# Altium project HAB-Main-Flight-Computer-Card-Template.PrjPcb (part 2 of 4)

## Sheet NetworkSwitch.SchDoc
size A2; Organization: Altium Limited; Address1: L3, 12a Rodborough Rd; Address2: Frenchs Forest; Address3: NSW; Address4: Australia 2086
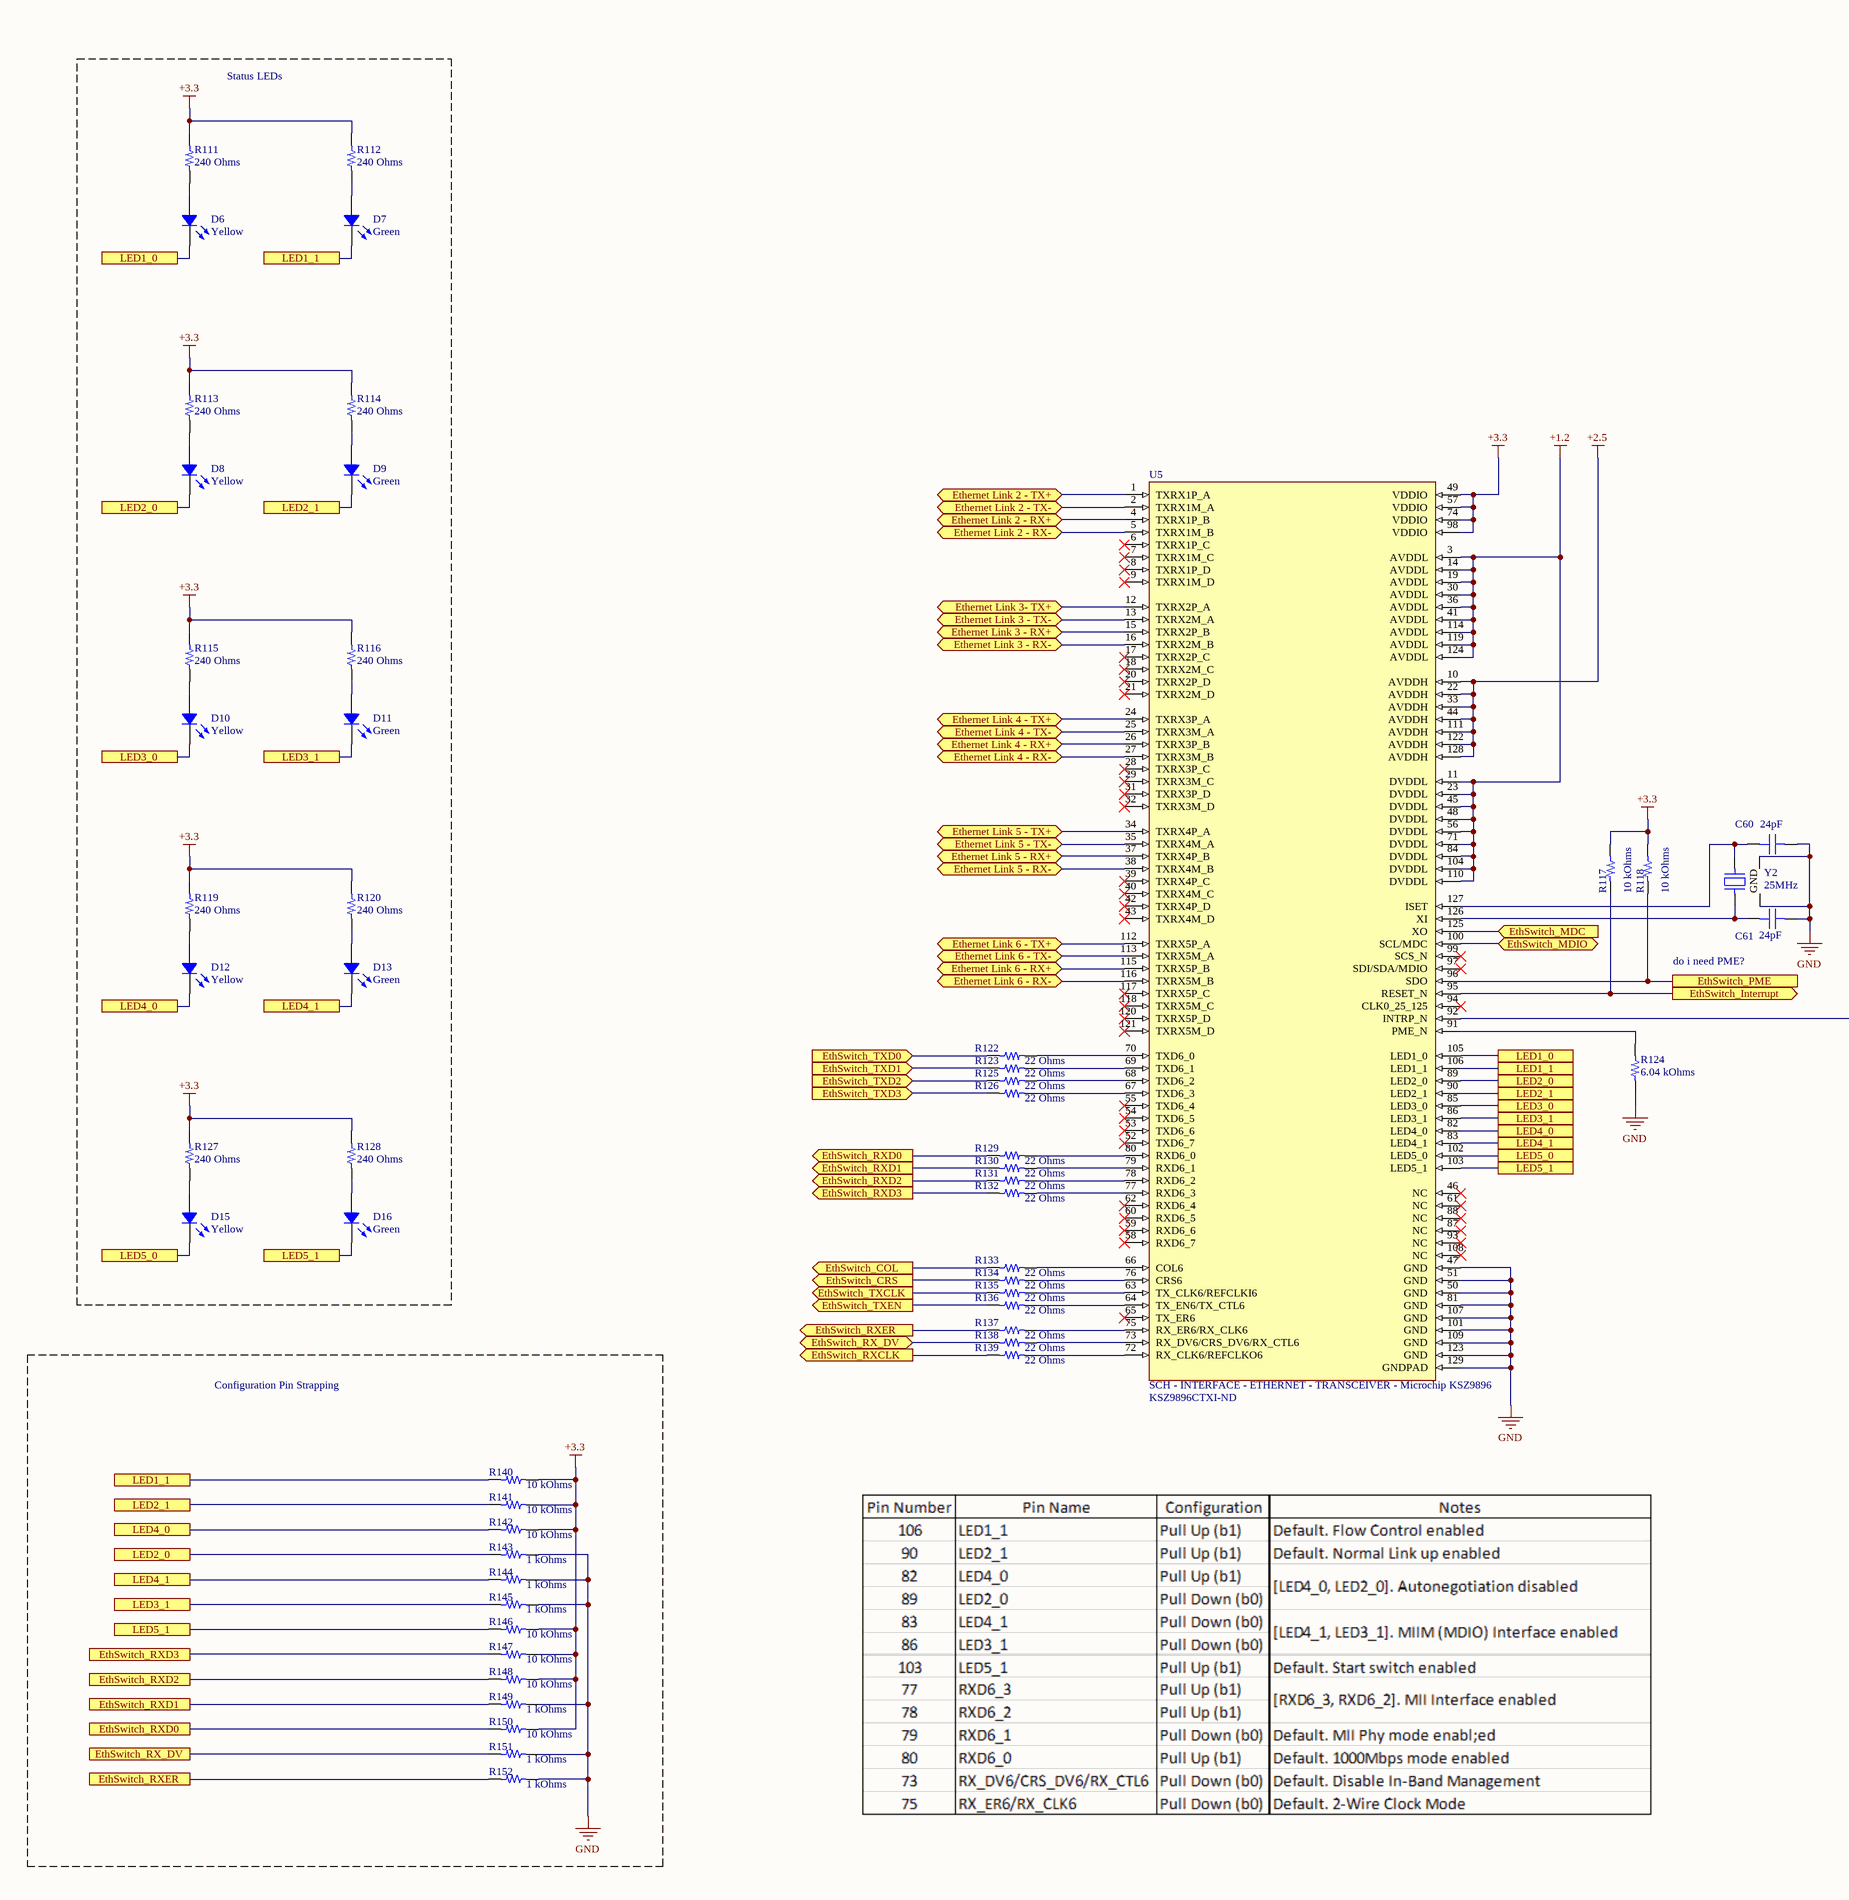
[diagram p2: NetworkSwitch.SchDoc, left]
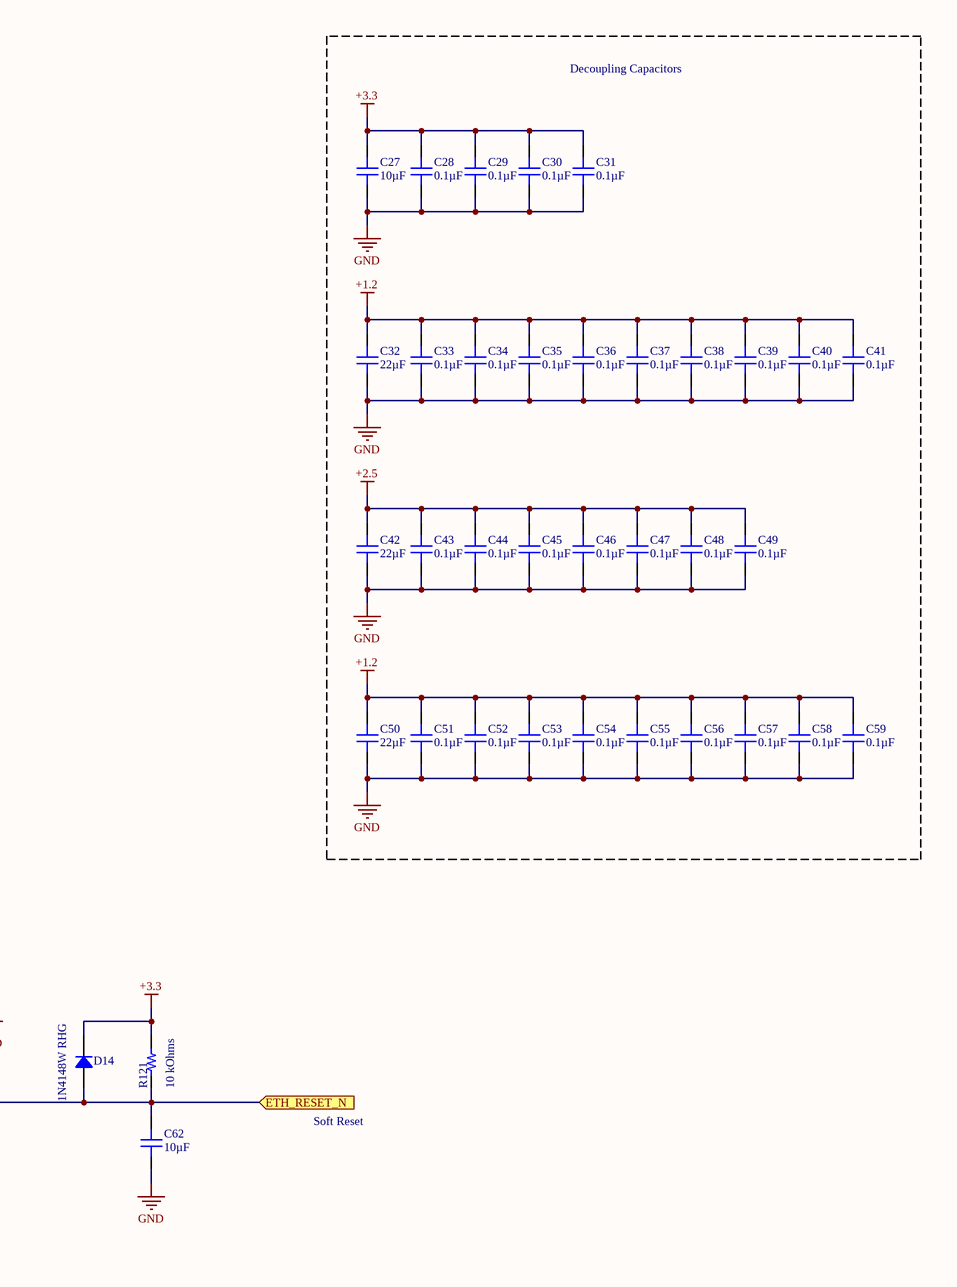
[diagram p3: NetworkSwitch.SchDoc, right]

### Parts
(Parts that share a designator on the sheet are numbered #1, #2 ... from top to bottom, then left to right.)
C27  10µF  [CAP 0805_2012]
C28  0.1µF  [CAP 0603_1608]
C29  0.1µF  [CAP 0603_1608]
C30  0.1µF  [CAP 0603_1608]
C31  0.1µF  [CAP 0603_1608]
C32  22µF  [CAP 0805_2012]
C33  0.1µF  [CAP 0603_1608]
C34  0.1µF  [CAP 0603_1608]
C35  0.1µF  [CAP 0603_1608]
C36  0.1µF  [CAP 0603_1608]
C37  0.1µF  [CAP 0603_1608]
C38  0.1µF  [CAP 0603_1608]
C39  0.1µF  [CAP 0603_1608]
C40  0.1µF  [CAP 0603_1608]
C41  0.1µF  [CAP 0603_1608]
C42  22µF  [CAP 0805_2012]
C43  0.1µF  [CAP 0603_1608]
C44  0.1µF  [CAP 0603_1608]
C45  0.1µF  [CAP 0603_1608]
C46  0.1µF  [CAP 0603_1608]
C47  0.1µF  [CAP 0603_1608]
C48  0.1µF  [CAP 0603_1608]
C49  0.1µF  [CAP 0603_1608]
C50  22µF  [CAP 0805_2012]
C51  0.1µF  [CAP 0603_1608]
C52  0.1µF  [CAP 0603_1608]
C53  0.1µF  [CAP 0603_1608]
C54  0.1µF  [CAP 0603_1608]
C55  0.1µF  [CAP 0603_1608]
C56  0.1µF  [CAP 0603_1608]
C57  0.1µF  [CAP 0603_1608]
C58  0.1µF  [CAP 0603_1608]
C59  0.1µF  [CAP 0603_1608]
C60  24pF  [CAP 0603_1608]
C61  24pF  [CAP 0603_1608]
C62  10µF  [CAP 0805_2012]
D6  Yellow  [LED 0603_1608 YELLOW]
D7  Green  [LED 0603_1608 GREEN]
D8  Yellow  [LED 0603_1608 YELLOW]
D9  Green  [LED 0603_1608 GREEN]
D10  Yellow  [LED 0603_1608 YELLOW]
D11  Green  [LED 0603_1608 GREEN]
D12  Yellow  [LED 0603_1608 YELLOW]
D13  Green  [LED 0603_1608 GREEN]
D14#1  1N4148W RHG  [SOD123F]
D15#1  Yellow  [LED 0603_1608 YELLOW]
D16#1  Green  [LED 0603_1608 GREEN]
R111  240 Ohms  [RES 0603_1608]
R112  240 Ohms  [RES 0603_1608]
R113  240 Ohms  [RES 0603_1608]
R114  240 Ohms  [RES 0603_1608]
R115  240 Ohms  [RES 0603_1608]
R116  240 Ohms  [RES 0603_1608]
R117  10 kOhms  [RES 0603_1608]
R118  10 kOhms  [RES 0603_1608]
R119  240 Ohms  [RES 0603_1608]
R120  240 Ohms  [RES 0603_1608]
R121#1  10 kOhms  [RES 0603_1608]
R122#1  22 Ohms  [RES 0603_1608]
R123#1  22 Ohms  [RES 0603_1608]
R124#1  6.04 kOhms  [RES 0603_1608]
R125#1  22 Ohms  [RES 0603_1608]
R126#1  22 Ohms  [RES 0603_1608]
R127#1  240 Ohms  [RES 0603_1608]
R128#1  240 Ohms  [RES 0603_1608]
R129#1  22 Ohms  [RES 0603_1608]
R130#1  22 Ohms  [RES 0603_1608]
R131#1  22 Ohms  [RES 0603_1608]
R132#1  22 Ohms  [RES 0603_1608]
R133#1  22 Ohms  [RES 0603_1608]
R134#1  22 Ohms  [RES 0603_1608]
R135#1  22 Ohms  [RES 0603_1608]
R136  22 Ohms  [RES 0603_1608]
R137  22 Ohms  [RES 0603_1608]
R138  22 Ohms  [RES 0603_1608]
R139  22 Ohms  [RES 0603_1608]
R140  10 kOhms  [RES 0603_1608]
R141  10 kOhms  [RES 0603_1608]
R142  10 kOhms  [RES 0603_1608]
R143  1 kOhms  [RES 0603_1608]
R144  1 kOhms  [RES 0603_1608]
R145  1 kOhms  [RES 0603_1608]
R146  10 kOhms  [RES 0603_1608]
R147#1  10 kOhms  [RES 0603_1608]
R148  10 kOhms  [RES 0603_1608]
R149  1 kOhms  [RES 0603_1608]
R150  10 kOhms  [RES 0603_1608]
R151  1 kOhms  [RES 0603_1608]
R152  1 kOhms  [RES 0603_1608]
U5#2  SCH - INTERFACE - ETHERNET - TRANSCEIVER - Microchip KSZ9896  Supplier Part Number 1: KSZ9896CTXI-ND  [PCB - LEADS - QFP - Microchip 128-TQFP]
Y2#1  25MHz  [EPSON TSX-3225]

### Blocks framed on the sheet
Status LEDs: D6-D13 D15#1 D16#1 R111-R116 R119 R120 R127#1 R128#1
Decoupling Capacitors: C27-C59
Configuration Pin Strapping: R140-R146 R147#1 R148-R152

### Ports
ETH_RESET_N (in), Ethernet Link 2 - RX+ (bidir), Ethernet Link 2 - RX- (bidir), Ethernet Link 2 - TX+ (bidir), Ethernet Link 2 - TX- (bidir), Ethernet Link 3 - RX+ (bidir), Ethernet Link 3 - RX- (bidir), Ethernet Link 3 - TX- (bidir), Ethernet Link 3- TX+ (bidir), Ethernet Link 4 - RX+ (bidir), Ethernet Link 4 - RX- (bidir), Ethernet Link 4 - TX+ (bidir), Ethernet Link 4 - TX- (bidir), Ethernet Link 5 - RX+ (bidir), Ethernet Link 5 - RX- (bidir), Ethernet Link 5 - TX+ (bidir), Ethernet Link 5 - TX- (bidir), Ethernet Link 6 - RX+ (bidir), Ethernet Link 6 - RX- (bidir), Ethernet Link 6 - TX+ (bidir), Ethernet Link 6 - TX- (bidir), EthSwitch_COL (out), EthSwitch_CRS (out), EthSwitch_Interrupt (out), EthSwitch_MDC (in), EthSwitch_MDIO (bidir), EthSwitch_PME, EthSwitch_RX_DV, EthSwitch_RX_DV (bidir), EthSwitch_RXCLK (out), EthSwitch_RXD0, EthSwitch_RXD0 (out), EthSwitch_RXD1, EthSwitch_RXD1 (out), EthSwitch_RXD2, EthSwitch_RXD2 (out), EthSwitch_RXD3, EthSwitch_RXD3 (out), EthSwitch_RXER, EthSwitch_RXER (out), EthSwitch_TXCLK (out), EthSwitch_TXD0 (in), EthSwitch_TXD1 (in), EthSwitch_TXD2 (in), EthSwitch_TXD3 (in), EthSwitch_TXEN (out), LED1_0, LED1_1, LED2_0, LED2_1, LED3_0, LED3_1, LED4_0, LED4_1, LED5_0, LED5_1

### Nets
+1.2: C32.2 C33.2 C34.2 C35.2 C36.2 C37.2 C38.2 C39.2 C40.2 C41.2 C50.2 C51.2 C52.2 C53.2 C54.2 C55.2 C56.2 C57.2 C58.2 C59.2 U5#2.3(AVDDL) U5#2.11(DVDDL) U5#2.14(AVDDL) U5#2.19(AVDDL) U5#2.23(DVDDL) U5#2.30(AVDDL) U5#2.36(AVDDL) U5#2.41(AVDDL) U5#2.45(DVDDL) U5#2.48(DVDDL) U5#2.56(DVDDL) U5#2.71(DVDDL) U5#2.84(DVDDL) U5#2.104(DVDDL) U5#2.110(DVDDL) U5#2.114(AVDDL) U5#2.119(AVDDL) U5#2.124(AVDDL)
+2.5: C42.2 C43.2 C44.2 C45.2 C46.2 C47.2 C48.2 C49.2 U5#2.10(AVDDH) U5#2.22(AVDDH) U5#2.33(AVDDH) U5#2.44(AVDDH) U5#2.111(AVDDH) U5#2.122(AVDDH) U5#2.128(AVDDH)
+3.3: C27.2 C28.2 C29.2 C30.2 C31.2 D14#1.2 R111.2 R112.2 R113.2 R114.2 R115.2 R116.2 R117.2 R118.2 R119.2 R120.2 R121#1.2 R127#1.2 R128#1.2 R140.1 R141.1 R142.1 R146.1 R147#1.1 R148.1 R150.1 U5#2.49(VDDIO) U5#2.57(VDDIO) U5#2.74(VDDIO) U5#2.98(VDDIO)
GND: C27.1 C28.1 C29.1 C30.1 C31.1 C32.1 C33.1 C34.1 C35.1 C36.1 C37.1 C38.1 C39.1 C40.1 C41.1 C42.1 C43.1 C44.1 C45.1 C46.1 C47.1 C48.1 C49.1 C50.1 C51.1 C52.1 C53.1 C54.1 C55.1 C56.1 C57.1 C58.1 C59.1 C60.2 C61.2 C62.1 R124#1.1 R143.1 R144.1 R145.1 R149.1 R151.1 R152.1 U5#2.47(GND) U5#2.50(GND) U5#2.51(GND) U5#2.81(GND) U5#2.101(GND) U5#2.107(GND) U5#2.109(GND) U5#2.123(GND) U5#2.129(GNDPAD) Y2#1.2(GND) Y2#1.4(GND)
ETH2_RX_N: U5#2.5(TXRX1M_B) ; port Ethernet Link 2 - RX-
ETH2_RX_P: U5#2.4(TXRX1P_B) ; port Ethernet Link 2 - RX+
ETH2_TX_N: U5#2.2(TXRX1M_A) ; port Ethernet Link 2 - TX-
ETH2_TX_P: U5#2.1(TXRX1P_A) ; port Ethernet Link 2 - TX+
ETH3_RX_N: U5#2.16(TXRX2M_B) ; port Ethernet Link 3 - RX-
ETH3_RX_P: U5#2.15(TXRX2P_B) ; port Ethernet Link 3 - RX+
ETH3_TX_N: U5#2.13(TXRX2M_A) ; port Ethernet Link 3 - TX-
ETH3_TX_P: U5#2.12(TXRX2P_A) ; port Ethernet Link 3- TX+
ETH4_RX_N: U5#2.27(TXRX3M_B) ; port Ethernet Link 4 - RX-
ETH4_RX_P: U5#2.26(TXRX3P_B) ; port Ethernet Link 4 - RX+
ETH4_TX_N: U5#2.25(TXRX3M_A) ; port Ethernet Link 4 - TX-
ETH4_TX_P: U5#2.24(TXRX3P_A) ; port Ethernet Link 4 - TX+
ETH5_RX_N: U5#2.38(TXRX4M_B) ; port Ethernet Link 5 - RX-
ETH5_RX_P: U5#2.37(TXRX4P_B) ; port Ethernet Link 5 - RX+
ETH5_TX_N: U5#2.35(TXRX4M_A) ; port Ethernet Link 5 - TX-
ETH5_TX_P: U5#2.34(TXRX4P_A) ; port Ethernet Link 5 - TX+
ETH6_RX_N: U5#2.116(TXRX5M_B) ; port Ethernet Link 6 - RX-
ETH6_RX_P: U5#2.115(TXRX5P_B) ; port Ethernet Link 6 - RX+
ETH6_TX_N: U5#2.113(TXRX5M_A) ; port Ethernet Link 6 - TX-
ETH6_TX_P: U5#2.112(TXRX5P_A) ; port Ethernet Link 6 - TX+
NetC60_1: C60.1 U5#2.127(ISET) Y2#1.3
NetC61_1: C61.1 U5#2.126(XI) Y2#1.1
NetC62_2: C62.2 D14#1.1 R121#1.1 U5#2.92(INTRP_N) ; port ETH_RESET_N
NetD6_1: D6.1 R111.1
NetD6_2: D6.2 U5#2.105(LED1_0) ; port LED1_0
NetD7_1: D7.1 R112.1
NetD7_2: D7.2 R140.2 U5#2.106(LED1_1) ; port LED1_1
NetD8_1: D8.1 R113.1
NetD8_2: D8.2 R143.2 U5#2.89(LED2_0) ; port LED2_0
NetD9_1: D9.1 R114.1
NetD9_2: D9.2 R141.2 U5#2.90(LED2_1) ; port LED2_1
NetD10_1: D10.1 R115.1
NetD10_2: D10.2 U5#2.85(LED3_0) ; port LED3_0
NetD11_1: D11.1 R116.1
NetD11_2: D11.2 R145.2 U5#2.86(LED3_1) ; port LED3_1
NetD12_1: D12.1 R119.1
NetD12_2: D12.2 R142.2 U5#2.82(LED4_0) ; port LED4_0
NetD13_1: D13.1 R120.1
NetD13_2: D13.2 R144.2 U5#2.83(LED4_1) ; port LED4_1
NetD15#1_1: D15#1.1 R127#1.1
NetD15#1_2: D15#1.2 U5#2.102(LED5_0) ; port LED5_0
NetD16#1_1: D16#1.1 R128#1.1
NetD16#1_2: D16#1.2 R146.2 U5#2.103(LED5_1) ; port LED5_1
NetR62_2: R122#1.1 ; port EthSwitch_TXD0
NetR63_2: R123#1.1 ; port EthSwitch_TXD1
NetR64_2: R125#1.1 ; port EthSwitch_TXD2
NetR65_2: R126#1.1 ; port EthSwitch_TXD3
NetR117_1: R117.1 U5#2.95(RESET_N) ; port EthSwitch_Interrupt
NetR118_1: R118.1 U5#2.96(SDO) ; port EthSwitch_PME
NetR122#1_2: R122#1.2 U5#2.70(TXD6_0)
NetR123#1_2: R123#1.2 U5#2.69(TXD6_1)
NetR124#1_2: R124#1.2 U5#2.91(PME_N)
NetR125#1_2: R125#1.2 U5#2.68(TXD6_2)
NetR126#1_2: R126#1.2 U5#2.67(TXD6_3)
NetR129#1_1: R129#1.1 R150.2 ; port EthSwitch_RXD0
NetR129#1_2: R129#1.2 U5#2.80(RXD6_0)
NetR130#1_1: R130#1.1 R149.2 ; port EthSwitch_RXD1
NetR130#1_2: R130#1.2 U5#2.79(RXD6_1)
NetR131#1_1: R131#1.1 R148.2 ; port EthSwitch_RXD2
NetR131#1_2: R131#1.2 U5#2.78(RXD6_2)
NetR131#2_1: U5#2.100(SCL/MDC) ; port EthSwitch_MDIO
NetR132#1_1: R132#1.1 R147#1.2 ; port EthSwitch_RXD3
NetR132#1_2: R132#1.2 U5#2.77(RXD6_3)
NetR133#1_1: R133#1.1 ; port EthSwitch_COL
NetR133#1_2: R133#1.2 U5#2.66(COL6)
NetR134#1_1: R134#1.1 ; port EthSwitch_CRS
NetR134#1_2: R134#1.2 U5#2.76(CRS6)
NetR135#1_1: R135#1.1 ; port EthSwitch_TXCLK
NetR135#1_2: R135#1.2 U5#2.63(TX_CLK6/REFCLKI6)
NetR136_1: R136.1 ; port EthSwitch_TXEN
NetR136_2: R136.2 U5#2.64(TX_EN6/TX_CTL6)
NetR137_1: R137.1 R152.2 ; port EthSwitch_RXER
NetR137_2: R137.2 U5#2.75(RX_ER6/RX_CLK6)
NetR138_1: R138.1 R151.2 ; port EthSwitch_RX_DV
NetR138_2: R138.2 U5#2.73(RX_DV6/CRS_DV6/RX_CTL6)
NetR139_1: R139.1 ; port EthSwitch_RXCLK
NetR139_2: R139.2 U5#2.72(RX_CLK6/REFCLKO6)
NetU5#2_125: U5#2.125(XO) ; port EthSwitch_MDC

Not connected (* = marked no-connect by the designer): U5#2 6(TXRX1P_C)* 7(TXRX1M_C)* 8(TXRX1P_D)* 9(TXRX1M_D)* 17(TXRX2P_C)* 18(TXRX2M_C)* 20(TXRX2P_D)* 21(TXRX2M_D)* 28(TXRX3P_C)* 29(TXRX3M_C)* 31(TXRX3P_D)* 32(TXRX3M_D)* 39(TXRX4P_C)* 40(TXRX4M_C)* 42(TXRX4P_D)* 43(TXRX4M_D)* 46(NC)* 52(TXD6_7)* 53(TXD6_6)* 54(TXD6_5)* 55(TXD6_4)* 58(RXD6_7)* 59(RXD6_6)* 60(RXD6_5)* 61(NC)* 62(RXD6_4)* 65(TX_ER6)* 87(NC)* 88(NC)* 93(NC)* 94(CLK0_25_125)* 97(SDI/SDA/MDIO)* 99(SCS_N)* 108(NC)* 117(TXRX5P_C)* 118(TXRX5M_C)* 120(TXRX5P_D)* 121(TXRX5M_D)*

### Notes on the sheet
- (near C61) do i need PME?
- Soft Reset
- Title
- Size:
- Date:
- File:
- A2
- Number:
- Time:
- Revision:
- Sheet
- of

### Library data of the parts
C27 C62 = CC0805KKX5R7BB106: CAP CER 10UF 16V X5R 0805; Manufacturer: Yageo; Tolerance: ±10%; Part Number: CC0805KKX5R7BB106; Value: 10µF; Applications: General Purpose; Capacitance: 10µF; ComponentLink1Description: Datasheet; ComponentLink1URL: https://www.yageo.com/upload/media/product/productsearch/datasheet/mlcc/UPY-GPHC_X5R_4V-to-50V_25.pdf; ComponentLink2Description: DigiKey Link; ComponentLink2URL: http://digikey.com/product-detail/en/yageo/CC0805KKX5R7BB106/311-1865-1-ND/5195767; Device Package: 0805 (2012 Metric); LastUpdated: 9/2/2020 1:04:30 AM; Lifecycle Status: Active; Minimum Order: 1; Mounting Type: Surface Mount, MLCC; Operating Temperature: -55°C ~ 85°C; Package / Case: 0805 (2012 Metric); Packaging: TapeAndReel; PartId: 8867; Part Status: Active; Price: 0.09; Series: CC; Size / Dimension: 0.079" L x 0.049" W (2.00mm x 1.25mm); Supplier 1: DigiKey; Supplier Part Number 1: 311-1865-1-ND; Temperature Coefficient: X5R; Thickness (Max): 0.057" (1.45mm); Voltage - Rated: 16V
C28-C31 C33-C41 C43-C49 C51-C59 = CL10B104KA8WPNC: CAP CER 0.1UF 25V X7R 0603; Manufacturer: Samsung Electro-Mechanics; Tolerance: ±10%; Part Number: CL10B104KA8WPNC; Value: 0.1µF; Applications: Automotive; Capacitance: 0.1µF; ComponentLink1Description: Datasheet; ComponentLink1URL: http://www.samsungsem.com/kr/support/product-search/mlcc/CL10B104KA8WPNC.jsp; ComponentLink2Description: DigiKey Link; ComponentLink2URL: http://digikey.com/product-detail/en/samsung-electro-mechanics/CL10B104KA8WPNC/1276-6717-1-ND/5961576; Device Package: 0603 (1608 Metric); Features: Open Mode; LastUpdated: 9/2/2020 1:03:30 AM; Lifecycle Status: Active; Minimum Order: 1; Mounting Type: Surface Mount, MLCC; Operating Temperature: -55°C ~ 125°C; Package / Case: 0603 (1608 Metric); Packaging: TapeAndReel; PartId: 5631; Part Status: Active; Price: 0.02; Ratings: AEC-Q200; Series: CL; Size / Dimension: 0.063" L x 0.031" W (1.60mm x 0.80mm); Supplier 1: DigiKey; Supplier Part Number 1: 1276-6717-1-ND; Temperature Coefficient: X7R; Thickness (Max): 0.035" (0.90mm); Voltage - Rated: 25V
C32 C42 C50 = CL21A226KPCLRNC: CAP CER 22UF 10V X5R 0805; Manufacturer: Samsung Electro-Mechanics; Tolerance: ±10%; Part Number: CL21A226KPCLRNC; Value: 22µF; Applications: General Purpose; Capacitance: 22µF; ComponentLink1Description: Datasheet; ComponentLink1URL: http://www.samsungsem.com/kr/support/product-search/mlcc/CL21A226KPCLRNC.jsp; ComponentLink2Description: DigiKey Link; ComponentLink2URL: http://digikey.com/product-detail/en/samsung-electro-mechanics/CL21A226KPCLRNC/1276-6786-1-ND/5961645; Device Package: 0805 (2012 Metric); Features: Low Profile; LastUpdated: 9/2/2020 1:04:38 AM; Lifecycle Status: Active; Minimum Order: 1; Mounting Type: Surface Mount, MLCC; Operating Temperature: -55°C ~ 85°C; Package / Case: 0805 (2012 Metric); Packaging: TapeAndReel; PartId: 4833; Part Status: Active; Price: 0.08; Series: CL; Size / Dimension: 0.079" L x 0.049" W (2.00mm x 1.25mm); Supplier 1: DigiKey; Supplier Part Number 1: 1276-6786-1-ND; Temperature Coefficient: X5R; Thickness (Max): 0.037" (0.95mm); Voltage - Rated: 10V
C60 C61 = CL10C240JB8NNNC: CAP CER 24PF 50V C0G/NP0 0603; Manufacturer: Samsung Electro-Mechanics; Temperature Coefficient: C0G, NP0; Tolerance: ±5%; Part Number: CL10C240JB8NNNC; Value: 24pF; Applications: General Purpose; Capacitance: 24pF; ComponentLink1Description: Datasheet; ComponentLink1URL: http://www.samsungsem.com/kr/support/product-search/mlcc/CL10C240JB8NNNC.jsp; ComponentLink2Description: DigiKey Link; ComponentLink2URL: http://digikey.com/product-detail/en/samsung-electro-mechanics/CL10C240JB8NNNC/1276-1761-1-ND/3889847; Device Package: 0603 (1608 Metric); LastUpdated: 9/2/2020 1:03:22 AM; Lifecycle Status: Active; Minimum Order: 1; Mounting Type: Surface Mount, MLCC; Operating Temperature: -55°C ~ 125°C; Package / Case: 0603 (1608 Metric); Packaging: TapeAndReel; PartId: 10003; Part Status: Active; Price: 0.01; Series: CL; Size / Dimension: 0.063" L x 0.031" W (1.60mm x 0.80mm); Supplier 1: DigiKey; Supplier Part Number 1: 1276-1761-1-ND; Thickness (Max): 0.035" (0.90mm); Voltage - Rated: 50V
D6 D8 D10 D12 D15#1 = LTST-C194KSKT: LED YELLOW CLEAR SMD; Manufacturer: Lite-On Inc.; Configuration: Standard; Current - Test: 20mA; Lens Color: Colorless; Lens Size: 1.15mm x 0.80mm; Lens Style: Rectangle with Flat Top; Millicandela Rating: 104mcd; Viewing Angle: 130°; Voltage - Forward (Vf) (Typ): 2V; Wavelength - Dominant: 592nm; Wavelength - Peak: 588nm; Part Number: LTST-C194KSKT; Color: Yellow; ComponentLink1Description: Datasheet; ComponentLink1URL: http://optoelectronics.liteon.com/upload/download/DS22-2006-114/LTST-C194KSKT.PDF; ComponentLink2Description: DigiKey Link; ComponentLink2URL: http://digikey.com/product-detail/en/lite-on-inc/LTST-C194KSKT/160-1836-1-ND/2356234; Device Package: 0603 (1608 Metric); Height (Max): 0.45mm; LastUpdated: 9/2/2020 1:21:17 AM; Lens Transparency: Clear; Lifecycle Status: Active; Minimum Order: 1; Mounting Type: Surface Mount; Package / Case: 0603 (1608 Metric); Packaging: TapeAndReel; PartId: 148; Part Status: Active; Price: 0.06; Series: -; Size / Dimension: 1.60mm L x 0.80mm W; Supplier 1: DigiKey; Supplier Part Number 1: 160-1836-1-ND; Value: Yellow
D7 D9 D11 D13 D16#1 = LTST-C193KGKT-5A: LED GREEN CLEAR CHIP SMD; Manufacturer: Lite-On Inc.; Configuration: Standard; Current - Test: 5mA; Lens Color: Colorless; Lens Size: 1.15mm x 0.80mm; Lens Style: Rectangle with Flat Top; Millicandela Rating: 16.25mcd; Viewing Angle: 130°; Voltage - Forward (Vf) (Typ): 2V; Wavelength - Dominant: 572nm; Wavelength - Peak: 574nm; Part Number: LTST-C193KGKT-5A; Color: Green; ComponentLink1Description: Datasheet; ComponentLink1URL: http://optoelectronics.liteon.com/upload/download/DS22-2007-0094/LTST-C193KGKT-5A.PDF; ComponentLink2Description: DigiKey Link; ComponentLink2URL: http://digikey.com/product-detail/en/lite-on-inc/LTST-C193KGKT-5A/160-1828-1-ND/2356247; Device Package: 0603 (1608 Metric); Height (Max): 0.45mm; LastUpdated: 9/2/2020 1:20:41 AM; Lens Transparency: Clear; Lifecycle Status: Active; Minimum Order: 1; Mounting Type: Surface Mount; Package / Case: 0603 (1608 Metric); Packaging: TapeAndReel; PartId: 694; Part Status: Active; Price: 0.06; Series: -; Size / Dimension: 1.60mm L x 0.80mm W; Supplier 1: DigiKey; Supplier Part Number 1: 160-1828-1-ND; Supplier Device Package: Chip LED; Value: Green
D14#1 = 1N4148W RHG: DIODE GEN PURP 100V 150MA SOD123; Manufacturer: Taiwan Semiconductor Corporation; Current - Average Rectified (Io): 150mA (DC); Current - Reverse Leakage @ Vr: 5µA @ 75V; Diode Type: Standard; Reverse Recovery Time (trr): 4ns; Speed: Fast Recovery =< 500ns, > 200mA (Io); Voltage - Forward (Vf) (Max) @ If: 1V @ 100mA; Part Number: 1N4148W RHG; ComponentLink1Description: Datasheet; ComponentLink1URL: https://www.taiwansemi.com/products/datasheet/1N4148W%20SERIES_K1804.pdf; ComponentLink2Description: DigiKey Link; ComponentLink2URL: http://digikey.com/product-detail/en/taiwan-semiconductor-corporation/1N4148W-RHG/1N4148WRHGCT-ND/7357066; LastUpdated: 9/2/2020 1:19:10 AM; Lifecycle Status: Active; Minimum Order: 1; Mounting Type: Surface Mount; Operating Temperature - Junction: -65°C ~ 150°C; Package / Case: SOD-123F; Packaging: TapeAndReel; PartId: 1073; Part Status: Active; Price: 0.03; Series: -; Supplier 1: DigiKey; Supplier Part Number 1: 1N4148WRHGCT-ND; Supplier Device Package: SOD-123F; Voltage - DC Reverse (Vr) (Max): 100V
R111-R116 R119 R120 R127#1 R128#1 = RMCF0603JT240R: RES 240 OHM 5% 1/10W 0603; Manufacturer: Stackpole Electronics Inc; Power (Watts): 0.1W, 1/10W; Temperature Coefficient: ±200ppm/°C; Part Number: RMCF0603JT240R; Value: 240 Ohms; ComponentLink1Description: Datasheet; ComponentLink1URL: https://www.seielect.com/catalog/sei-rmcf_rmcp.pdf; ComponentLink2Description: DigiKey Link; ComponentLink2URL: http://digikey.com/product-detail/en/stackpole-electronics-inc/RMCF0603JT240R/RMCF0603JT240RCT-ND/2418189; Composition: Thick Film; Device Package: 0603 (1608 Metric); Features: Automotive AEC-Q200; Height - Seated (Max): 0.022" (0.55mm); LastUpdated: 9/2/2020 1:10:22 AM; Lifecycle Status: Active; Minimum Order: 1; Number of Terminations: 2; Operating Temperature: -55°C ~ 155°C; Package / Case: 0603 (1608 Metric); Packaging: CutTape; PartId: 5995; Part Status: Active; Price: 0.10; Ratings: AEC-Q200; Resistance: 240 Ohms; Series: RMCF; Size / Dimension: 0.061" L x 0.031" W (1.55mm x 0.80mm); Supplier 1: DigiKey; Supplier Part Number 1: RMCF0603JT240RCT-ND; Supplier Device Package: 0603; Tolerance: ±5%
R117 R118 R121#1 R140-R142 R146 R147#1 R148 R150 = RMCF0603JT10K0: RES 10K OHM 5% 1/10W 0603; Manufacturer: Stackpole Electronics Inc; Power (Watts): 0.1W, 1/10W; Temperature Coefficient: ±200ppm/°C; Part Number: RMCF0603JT10K0; Value: 10 kOhms; ComponentLink1Description: Datasheet; ComponentLink1URL: https://www.seielect.com/catalog/sei-packaging.pdf; ComponentLink2Description: DigiKey Link; ComponentLink2URL: http://digikey.com/product-detail/en/stackpole-electronics-inc/RMCF0603JT10K0/RMCF0603JT10K0CT-ND/1943191; Composition: Thick Film; Device Package: 0603 (1608 Metric); Features: Automotive AEC-Q200; Height - Seated (Max): 0.022" (0.55mm); LastUpdated: 8/30/2020 8:48:45 PM; Lifecycle Status: Active; Minimum Order: 1; Number of Terminations: 2; Operating Temperature: -55°C ~ 155°C; Package / Case: 0603 (1608 Metric); Packaging: CutTape; PartId: 25659; Part Status: Active; Price: 0.10; Ratings: AEC-Q200; Resistance: 10 kOhms; Series: RMCF; Size / Dimension: 0.061" L x 0.031" W (1.55mm x 0.80mm); Supplier 1: DigiKey; Supplier Part Number 1: RMCF0603JT10K0CT-ND; Supplier Device Package: 0603; Tolerance: ±5%
R122#1 R123#1 R125#1 R126#1 R129#1 R130#1 R131#1 R132#1 R133#1 R134#1 R135#1 R136-R139 = RMCF0603FT22R0: RES 22 OHM 1% 1/10W 0603; Manufacturer: Stackpole Electronics Inc; Power (Watts): 0.1W, 1/10W; Temperature Coefficient: ±100ppm/°C; Part Number: RMCF0603FT22R0; Value: 22 Ohms; ComponentLink1Description: Datasheet; ComponentLink1URL: https://www.seielect.com/catalog/sei-packaging.pdf; ComponentLink2Description: DigiKey Link; ComponentLink2URL: http://digikey.com/product-detail/en/stackpole-electronics-inc/RMCF0603FT22R0/RMCF0603FT22R0CT-ND/1942946; Composition: Thick Film; Device Package: 0603 (1608 Metric); Features: Automotive AEC-Q200; Height - Seated (Max): 0.022" (0.55mm); LastUpdated: 9/2/2020 1:10:13 AM; Lifecycle Status: Active; Minimum Order: 1; Number of Terminations: 2; Operating Temperature: -55°C ~ 155°C; Package / Case: 0603 (1608 Metric); Packaging: CutTape; PartId: 10611; Part Status: Active; Price: 0.10; Ratings: AEC-Q200; Resistance: 22 Ohms; Series: RMCF; Size / Dimension: 0.061" L x 0.031" W (1.55mm x 0.80mm); Supplier 1: DigiKey; Supplier Part Number 1: RMCF0603FT22R0CT-ND; Supplier Device Package: 0603; Tolerance: ±1%
R124#1 = RMCF0603FT6K04: RES 6.04K OHM 1% 1/10W 0603; Manufacturer: Stackpole Electronics Inc; Power (Watts): 0.1W, 1/10W; Temperature Coefficient: ±100ppm/°C; Part Number: RMCF0603FT6K04; Value: 6.04 kOhms; ComponentLink1Description: Datasheet; ComponentLink1URL: https://www.seielect.com/catalog/sei-rmcf_rmcp.pdf; ComponentLink2Description: DigiKey Link; ComponentLink2URL: http://digikey.com/product-detail/en/stackpole-electronics-inc/RMCF0603FT6K04/RMCF0603FT6K04CT-ND/1943041; Composition: Thick Film; Device Package: 0603 (1608 Metric); Features: Automotive AEC-Q200; Height - Seated (Max): 0.022" (0.55mm); LastUpdated: 9/2/2020 1:10:13 AM; Lifecycle Status: Active; Minimum Order: 1; Number of Terminations: 2; Operating Temperature: -55°C ~ 155°C; Package / Case: 0603 (1608 Metric); Packaging: CutTape; PartId: 10873; Part Status: Active; Price: 0.10; Ratings: AEC-Q200; Resistance: 6.04 kOhms; Series: RMCF; Size / Dimension: 0.061" L x 0.031" W (1.55mm x 0.80mm); Supplier 1: DigiKey; Supplier Part Number 1: RMCF0603FT6K04CT-ND; Supplier Device Package: 0603; Tolerance: ±1%
R143-R145 R149 R151 R152 = RNCP0603FTD1K00: RES 1K OHM 1% 1/8W 0603; Manufacturer: Stackpole Electronics Inc; Power (Watts): 0.125W, 1/8W; Temperature Coefficient: ±100ppm/°C; Part Number: RNCP0603FTD1K00; Value: 1 kOhms; ComponentLink1Description: Datasheet; ComponentLink1URL: https://www.seielect.com/catalog/sei-rncp.pdf; ComponentLink2Description: DigiKey Link; ComponentLink2URL: http://digikey.com/product-detail/en/stackpole-electronics-inc/RNCP0603FTD1K00/RNCP0603FTD1K00CT-ND/2240445; Composition: Thin Film; Device Package: 0603 (1608 Metric); Features: Anti-Sulfur, Moisture Resistant; Height - Seated (Max): 0.020" (0.50mm); LastUpdated: 9/2/2020 1:10:23 AM; Lifecycle Status: Active; Minimum Order: 1; Number of Terminations: 2; Operating Temperature: -55°C ~ 155°C; Package / Case: 0603 (1608 Metric); Packaging: TapeAndReel; PartId: 5694; Part Status: Active; Price: 0.01; Resistance: 1 kOhms; Series: RNCP; Size / Dimension: 0.059" L x 0.031" W (1.50mm x 0.80mm); Supplier 1: DigiKey; Supplier Part Number 1: RNCP0603FTD1K00CT-ND; Supplier Device Package: 0603; Tolerance: ±1%
Y2#1 = TSX-3225 25.0000MF20P-C0: CRYSTAL 25.0000MHZ 18PF SMD; Manufacturer: EPSON; ESR (Equivalent Series Resistance): 40 Ohms; Frequency Stability: ±20ppm; Frequency Tolerance: ±10ppm; Operating Mode: Fundamental; Part Number: TSX-3225 25.0000MF20P-C0; ComponentLink1Description: Datasheet; ComponentLink1URL: https://support.epson.biz/td/api/doc_check.php?dl=brief_TSX-3225&lang=en; ComponentLink2Description: DigiKey Link; ComponentLink2URL: http://digikey.com/product-detail/en/epson/TSX-3225-25.0000MF20P-C0/SER4212CT-ND/7430967; Frequency: 25MHz; Height - Seated (Max): 0.024" (0.60mm); LastUpdated: 9/2/2020 1:21:54 AM; Lifecycle Status: Active; Load Capacitance: 18pF; Minimum Order: 1; Mounting Type: Surface Mount; Operating Temperature: -20°C ~ 85°C; Package / Case: 4-SMD, No Lead; Packaging: TapeAndReel; PartId: 447; Part Status: Active; Price: 0.18; Series: TSX-3225; Size / Dimension: 0.126" L x 0.098" W (3.20mm x 2.50mm); Supplier 1: DigiKey; Supplier Part Number 1: SER4212CT-ND; Type: MHz Crystal; Value: 25MHz
U5#2 = SCH - INTERFACE - ETHERNET - TRANSCEIVER - Microchip KSZ9896: Supplier 1: Digi-Key

## Sheet EthernetBridge.SchDoc: Main Flight Computer Ethernet Bridge
size A2; Organization: Brickworks; Address1: Matthew Glazer; Address2: Design Engineer; Revision: 1A; SheetNumber: 4; SheetTotal: 7
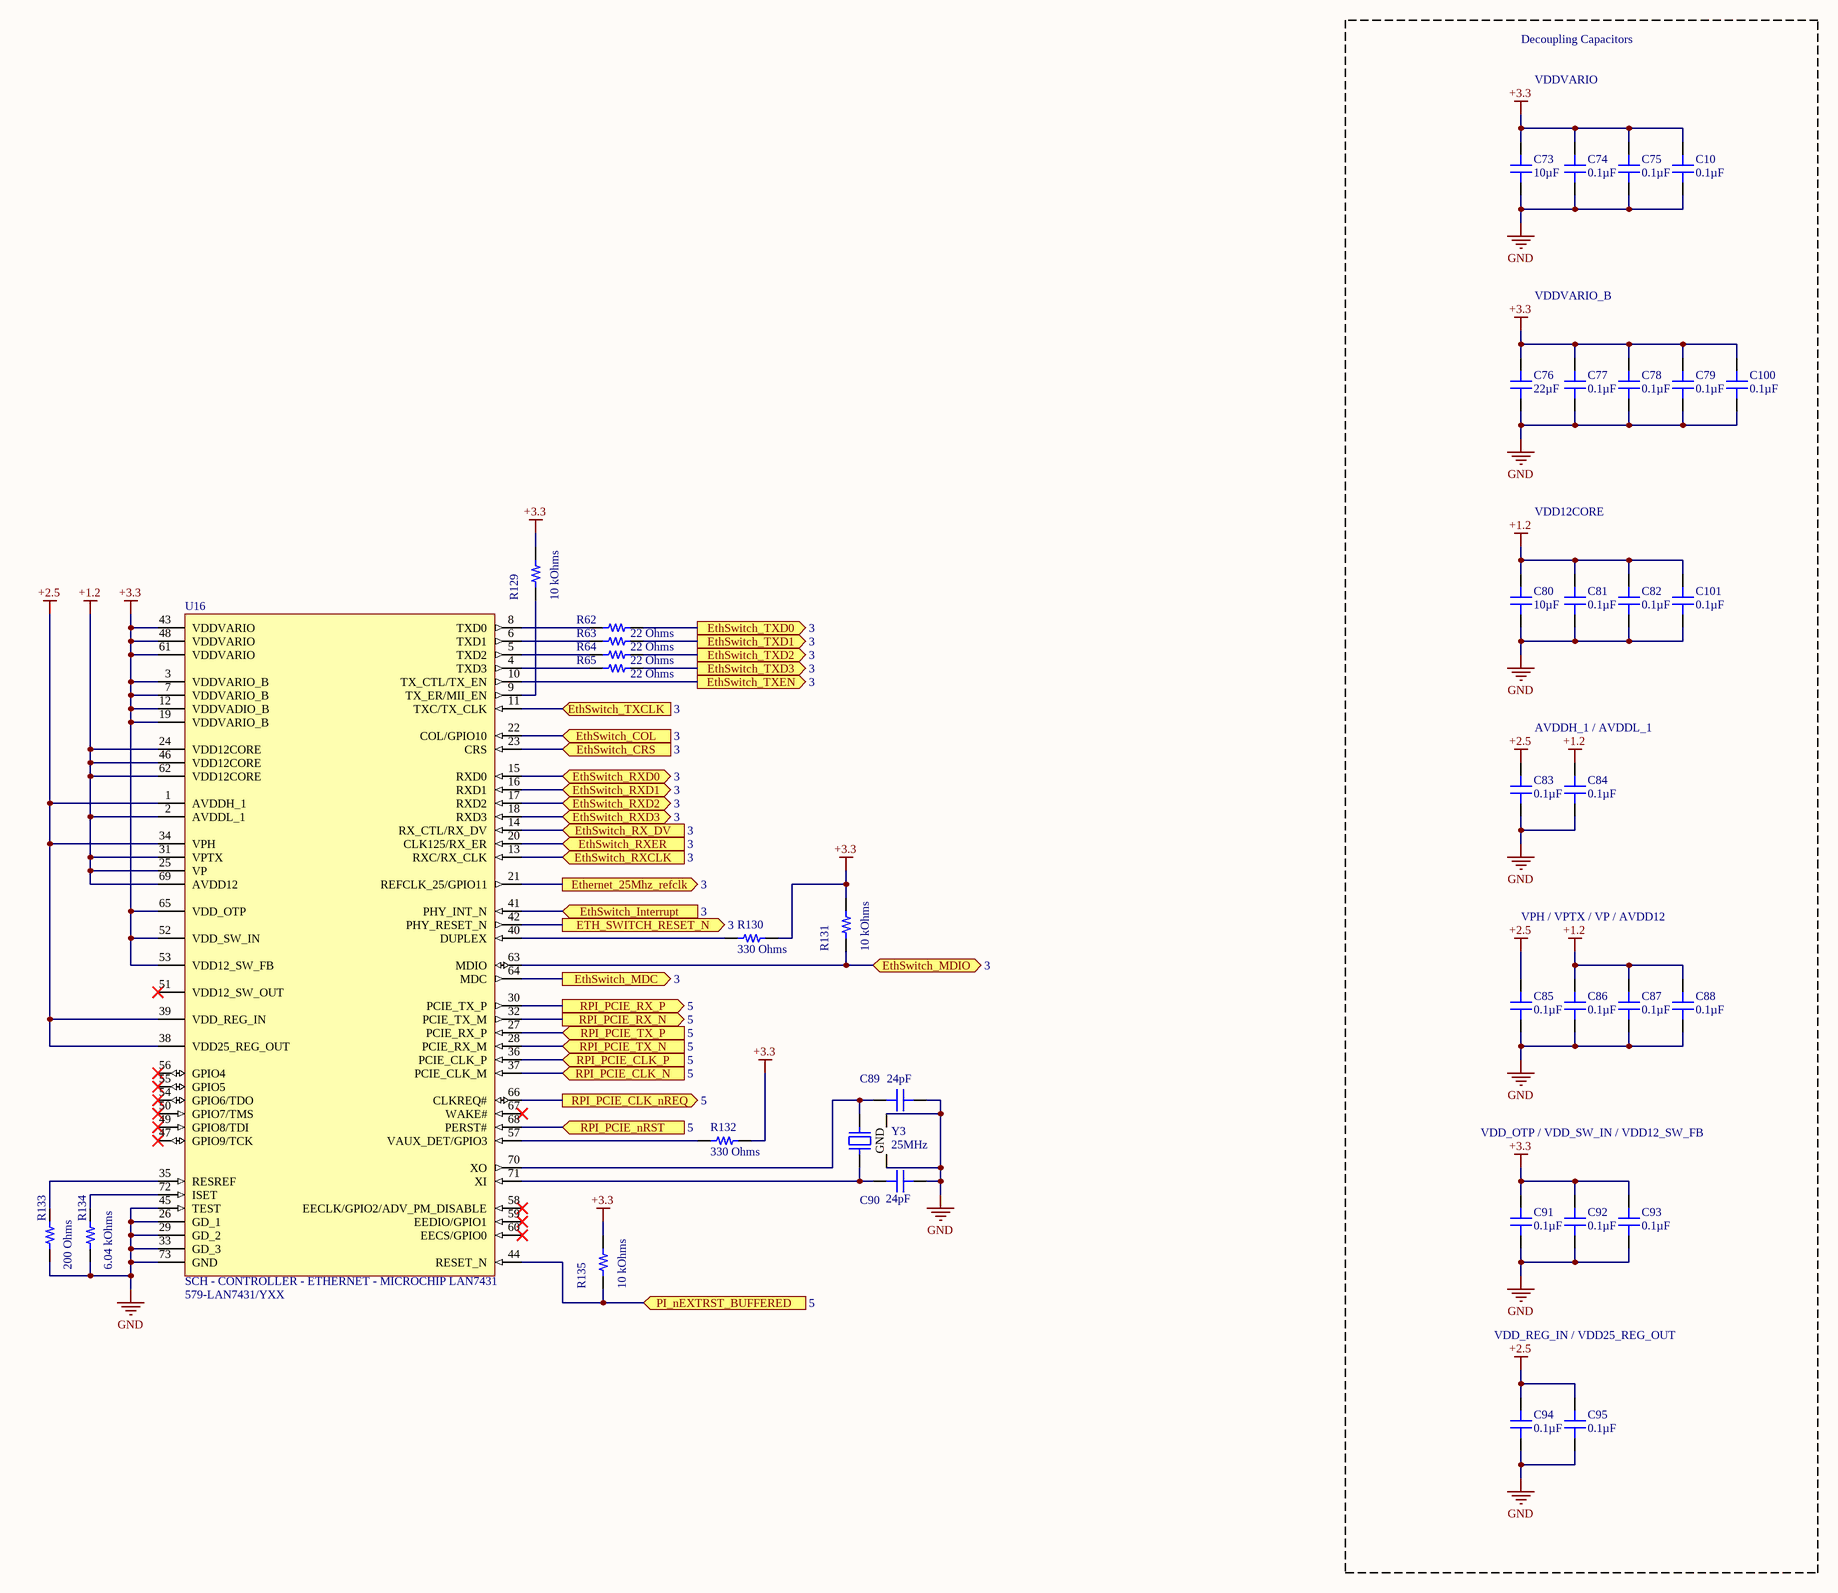
[diagram p4: EthernetBridge.SchDoc]

### Parts
(Parts that share a designator on the sheet are numbered #1, #2 ... from top to bottom, then left to right.)
C10  0.1µF  [CAP 0603_1608]
C73  10µF  [CAP 0805_2012]
C74  0.1µF  [CAP 0603_1608]
C75  0.1µF  [CAP 0603_1608]
C76  22µF  [CAP 0805_2012]
C77  0.1µF  [CAP 0603_1608]
C78  0.1µF  [CAP 0603_1608]
C79  0.1µF  [CAP 0603_1608]
C80  10µF  [CAP 0805_2012]
C81  0.1µF  [CAP 0603_1608]
C82  0.1µF  [CAP 0603_1608]
C83  0.1µF  [CAP 0603_1608]
C84  0.1µF  [CAP 0603_1608]
C85  0.1µF  [CAP 0603_1608]
C86  0.1µF  [CAP 0603_1608]
C87  0.1µF  [CAP 0603_1608]
C88  0.1µF  [CAP 0603_1608]
C89  24pF  [CAP 0603_1608]
C90  24pF  [CAP 0603_1608]
C91  0.1µF  [CAP 0603_1608]
C92  0.1µF  [CAP 0603_1608]
C93  0.1µF  [CAP 0603_1608]
C94  0.1µF  [CAP 0603_1608]
C95  0.1µF  [CAP 0603_1608]
C100  0.1µF  [CAP 0603_1608]
C101  0.1µF  [CAP 0603_1608]
R62  22 Ohms  [RES 0603_1608]
R63  22 Ohms  [RES 0603_1608]
R64  22 Ohms  [RES 0603_1608]
R65  22 Ohms  [RES 0603_1608]
R129#2  10 kOhms  [RES 0603_1608]
R130#2  330 Ohms  [RES 0603_1608]
R131#2  10 kOhms  [RES 0603_1608]
R132#2  330 Ohms  [RES 0603_1608]
R133#2  200 Ohms  [RES 0603_1608]
R134#2  6.04 kOhms  [RES 0603_1608]
R135#2  10 kOhms  [RES 0603_1608]
U16  SCH - CONTROLLER - ETHERNET - MICROCHIP LAN7431  Supplier Part Number 1: 579-LAN7431/YXX  [PCB - LEADLESS - QFN - MICROCHIP 72-SQFN]
Y3  25MHz  [EPSON TSX-3225]

### Ports
ETH_SWITCH_RESET_N (out, see 3), Ethernet_25Mhz_refclk (out, see 3), EthSwitch_COL (in, see 3), EthSwitch_CRS (in, see 3), EthSwitch_Interrupt (in, see 3), EthSwitch_MDC (out, see 3), EthSwitch_MDIO (bidir, see 3), EthSwitch_RX_DV (in, see 3), EthSwitch_RXCLK (in, see 3), EthSwitch_RXD0 (bidir, see 3), EthSwitch_RXD1 (bidir, see 3), EthSwitch_RXD2 (bidir, see 3), EthSwitch_RXD3 (bidir, see 3), EthSwitch_RXER (in, see 3), EthSwitch_TXCLK (in, see 3), EthSwitch_TXD0 (out, see 3), EthSwitch_TXD1 (out, see 3), EthSwitch_TXD2 (out, see 3), EthSwitch_TXD3 (out, see 3), EthSwitch_TXEN (out, see 3), PI_nEXTRST_BUFFERED (in, see 5), RPI_PCIE_CLK_N (in, see 5), RPI_PCIE_CLK_nREQ (out, see 5), RPI_PCIE_CLK_P (in, see 5), RPI_PCIE_nRST (in, see 5), RPI_PCIE_RX_N (out, see 5), RPI_PCIE_RX_P (out, see 5), RPI_PCIE_TX_N (in, see 5), RPI_PCIE_TX_P (in, see 5)

### Nets
+1.2: C80.2 C81.2 C82.2 C84.2 C86.2 C87.2 C88.2 C101.2 U16.2(AVDDL_1) U16.24(VDD12CORE) U16.25(VP) U16.31(VPTX) U16.46(VDD12CORE) U16.62(VDD12CORE) U16.69(AVDD12)
+2.5: C83.2 C85.2 C94.2 C95.2 U16.1(AVDDH_1) U16.34(VPH) U16.38(VDD25_REG_OUT) U16.39(VDD_REG_IN)
+3.3: C10.2 C73.2 C74.2 C75.2 C76.2 C77.2 C78.2 C79.2 C91.2 C92.2 C93.2 C100.2 R129#2.2 R130#2.1 R131#2.2 R132#2.2 R135#2.2 U16.3(VDDVARIO_B) U16.7(VDDVARIO_B) U16.12(VDDVADIO_B) U16.19(VDDVARIO_B) U16.43(VDDVARIO) U16.48(VDDVARIO) U16.52(VDD_SW_IN) U16.53(VDD12_SW_FB) U16.61(VDDVARIO) U16.65(VDD_OTP)
GND: C10.1 C73.1 C74.1 C75.1 C76.1 C77.1 C78.1 C79.1 C80.1 C81.1 C82.1 C83.1 C84.1 C85.1 C86.1 C87.1 C88.1 C89.2 C90.2 C91.1 C92.1 C93.1 C94.1 C95.1 C100.1 C101.1 R133#2.1 R134#2.1 U16.26(GD_1) U16.29(GD_2) U16.33(GD_3) U16.45(TEST) U16.73(GND) Y3.2(GND) Y3.4(GND)
NetC89_1: C89.1 U16.70(XO) Y3.3
NetC90_1: C90.1 U16.71(XI) Y3.1
NetR62_1: R62.1 U16.8(TXD0)
NetR62_2: R62.2 ; port EthSwitch_TXD0
NetR63_1: R63.1 U16.6(TXD1)
NetR63_2: R63.2 ; port EthSwitch_TXD1
NetR64_1: R64.1 U16.5(TXD2)
NetR64_2: R64.2 ; port EthSwitch_TXD2
NetR65_1: R65.1 U16.4(TXD3)
NetR65_2: R65.2 ; port EthSwitch_TXD3
NetR117_1: U16.41(PHY_INT_N) ; port EthSwitch_Interrupt
NetR129#1_1: U16.15(RXD0) ; port EthSwitch_RXD0
NetR129#2_1: R129#2.1 U16.9(TX_ER/MII_EN)
NetR130#1_1: U16.16(RXD1) ; port EthSwitch_RXD1
NetR130#2_2: R130#2.2 U16.40(DUPLEX)
NetR131#1_1: U16.17(RXD2) ; port EthSwitch_RXD2
NetR131#2_1: R131#2.1 U16.63(MDIO) ; port EthSwitch_MDIO
NetR132#1_1: U16.18(RXD3) ; port EthSwitch_RXD3
NetR132#2_1: R132#2.1 U16.57(VAUX_DET/GPIO3)
NetR133#1_1: U16.22(COL/GPIO10) ; port EthSwitch_COL
NetR133#2_2: R133#2.2 U16.35(RESREF)
NetR134#1_1: U16.23(CRS) ; port EthSwitch_CRS
NetR134#2_2: R134#2.2 U16.72(ISET)
NetR135#1_1: U16.11(TXC/TX_CLK) ; port EthSwitch_TXCLK
NetR135#2_1: R135#2.1 U16.44(RESET_N) ; port PI_nEXTRST_BUFFERED
NetR136_1: U16.10(TX_CTL/TX_EN) ; port EthSwitch_TXEN
NetR137_1: U16.20(CLK125/RX_ER) ; port EthSwitch_RXER
NetR138_1: U16.14(RX_CTL/RX_DV) ; port EthSwitch_RX_DV
NetR139_1: U16.13(RXC/RX_CLK) ; port EthSwitch_RXCLK
NetU1#2_102: U16.66(CLKREQ#) ; port RPI_PCIE_CLK_nREQ
NetU1#2_109: U16.68(PERST#) ; port RPI_PCIE_nRST
NetU1#2_110: U16.36(PCIE_CLK_P) ; port RPI_PCIE_CLK_P
NetU1#2_112: U16.37(PCIE_CLK_M) ; port RPI_PCIE_CLK_N
NetU1#2_116: U16.30(PCIE_TX_P) ; port RPI_PCIE_RX_P
NetU1#2_118: U16.32(PCIE_TX_M) ; port RPI_PCIE_RX_N
NetU1#2_122: U16.27(PCIE_RX_P) ; port RPI_PCIE_TX_P
NetU1#2_124: U16.28(PCIE_RX_M) ; port RPI_PCIE_TX_N
NetU5#2_125: U16.64(MDC) ; port EthSwitch_MDC
NetU16_21: U16.21(REFCLK_25/GPIO11) ; port Ethernet_25Mhz_refclk
NetU16_42: U16.42(PHY_RESET_N) ; port ETH_SWITCH_RESET_N

Not connected (* = marked no-connect by the designer): U16 47(GPIO9/TCK)* 49(GPIO8/TDI)* 50(GPIO7/TMS)* 51(VDD12_SW_OUT)* 54(GPIO6/TDO)* 55(GPIO5)* 56(GPIO4)* 58(EECLK/GPIO2/ADV_PM_DISABLE)* 59(EEDIO/GPIO1)* 60(EECS/GPIO0)* 67(WAKE#)*

### Notes on the sheet
- Decoupling Capacitors
- VDDVARIO
- VDDVARIO_B
- VDD12CORE
- AVDDH_1 / AVDDL_1
- VPH / VPTX / VP / AVDD12
- VDD_OTP / VDD_SW_IN / VDD12_SW_FB
- VDD_REG_IN / VDD25_REG_OUT
- Title
- Size:
- Date:
- File:
- A2
- Number:
- Time:
- Revision:
- Sheet
- of

### Library data of the parts
C10 C74 C75 C77-C79 C81-C88 C91-C95 C100 C101 = CL10B104KA8WPNC: as C28 on sheet NetworkSwitch; Part Number: CL10B104KA8WPNC; Value: 0.1µF; Applications: Automotive; Capacitance: 0.1µF; ComponentLink1Description: Datasheet; ComponentLink1URL: http://www.samsungsem.com/kr/support/product-search/mlcc/CL10B104KA8WPNC.jsp; ComponentLink2Description: DigiKey Link; ComponentLink2URL: http://digikey.com/product-detail/en/samsung-electro-mechanics/CL10B104KA8WPNC/1276-6717-1-ND/5961576; Device Package: 0603 (1608 Metric); Features: Open Mode; LastUpdated: 9/2/2020 1:03:30 AM; Lifecycle Status: Active; Minimum Order: 1; Mounting Type: Surface Mount, MLCC; Operating Temperature: -55°C ~ 125°C; Package / Case: 0603 (1608 Metric); Packaging: TapeAndReel; PartId: 5631; Part Status: Active; Price: 0.02; Ratings: AEC-Q200; Series: CL; Size / Dimension: 0.063" L x 0.031" W (1.60mm x 0.80mm); Supplier 1: DigiKey; Supplier Part Number 1: 1276-6717-1-ND; Temperature Coefficient: X7R; Thickness (Max): 0.035" (0.90mm); Voltage - Rated: 25V
C73 C80 = CC0805KKX5R7BB106: as C27 on sheet NetworkSwitch; Part Number: CC0805KKX5R7BB106; Value: 10µF; Applications: General Purpose; Capacitance: 10µF; ComponentLink1Description: Datasheet; ComponentLink1URL: https://www.yageo.com/upload/media/product/productsearch/datasheet/mlcc/UPY-GPHC_X5R_4V-to-50V_25.pdf; ComponentLink2Description: DigiKey Link; ComponentLink2URL: http://digikey.com/product-detail/en/yageo/CC0805KKX5R7BB106/311-1865-1-ND/5195767; Device Package: 0805 (2012 Metric); LastUpdated: 9/2/2020 1:04:30 AM; Lifecycle Status: Active; Minimum Order: 1; Mounting Type: Surface Mount, MLCC; Operating Temperature: -55°C ~ 85°C; Package / Case: 0805 (2012 Metric); Packaging: TapeAndReel; PartId: 8867; Part Status: Active; Price: 0.09; Series: CC; Size / Dimension: 0.079" L x 0.049" W (2.00mm x 1.25mm); Supplier 1: DigiKey; Supplier Part Number 1: 311-1865-1-ND; Temperature Coefficient: X5R; Thickness (Max): 0.057" (1.45mm); Voltage - Rated: 16V
C76 = CL21A226KPCLRNC: as C32 on sheet NetworkSwitch; Part Number: CL21A226KPCLRNC; Value: 22µF; Applications: General Purpose; Capacitance: 22µF; ComponentLink1Description: Datasheet; ComponentLink1URL: http://www.samsungsem.com/kr/support/product-search/mlcc/CL21A226KPCLRNC.jsp; ComponentLink2Description: DigiKey Link; ComponentLink2URL: http://digikey.com/product-detail/en/samsung-electro-mechanics/CL21A226KPCLRNC/1276-6786-1-ND/5961645; Device Package: 0805 (2012 Metric); Features: Low Profile; LastUpdated: 9/2/2020 1:04:38 AM; Lifecycle Status: Active; Minimum Order: 1; Mounting Type: Surface Mount, MLCC; Operating Temperature: -55°C ~ 85°C; Package / Case: 0805 (2012 Metric); Packaging: TapeAndReel; PartId: 4833; Part Status: Active; Price: 0.08; Series: CL; Size / Dimension: 0.079" L x 0.049" W (2.00mm x 1.25mm); Supplier 1: DigiKey; Supplier Part Number 1: 1276-6786-1-ND; Temperature Coefficient: X5R; Thickness (Max): 0.037" (0.95mm); Voltage - Rated: 10V
C89 C90 = CL10C240JB8NNNC: as C60 on sheet NetworkSwitch; Part Number: CL10C240JB8NNNC; Value: 24pF; Applications: General Purpose; Capacitance: 24pF; ComponentLink1Description: Datasheet; ComponentLink1URL: http://www.samsungsem.com/kr/support/product-search/mlcc/CL10C240JB8NNNC.jsp; ComponentLink2Description: DigiKey Link; ComponentLink2URL: http://digikey.com/product-detail/en/samsung-electro-mechanics/CL10C240JB8NNNC/1276-1761-1-ND/3889847; Device Package: 0603 (1608 Metric); LastUpdated: 9/2/2020 1:03:22 AM; Lifecycle Status: Active; Minimum Order: 1; Mounting Type: Surface Mount, MLCC; Operating Temperature: -55°C ~ 125°C; Package / Case: 0603 (1608 Metric); Packaging: TapeAndReel; PartId: 10003; Part Status: Active; Price: 0.01; Series: CL; Size / Dimension: 0.063" L x 0.031" W (1.60mm x 0.80mm); Supplier 1: DigiKey; Supplier Part Number 1: 1276-1761-1-ND; Thickness (Max): 0.035" (0.90mm); Voltage - Rated: 50V
R62-R65 = RMCF0603FT22R0: as R122#1 on sheet NetworkSwitch; Part Number: RMCF0603FT22R0; Value: 22 Ohms; ComponentLink1Description: Datasheet; ComponentLink1URL: https://www.seielect.com/catalog/sei-packaging.pdf; ComponentLink2Description: DigiKey Link; ComponentLink2URL: http://digikey.com/product-detail/en/stackpole-electronics-inc/RMCF0603FT22R0/RMCF0603FT22R0CT-ND/1942946; Composition: Thick Film; Device Package: 0603 (1608 Metric); Features: Automotive AEC-Q200; Height - Seated (Max): 0.022" (0.55mm); LastUpdated: 9/2/2020 1:10:13 AM; Lifecycle Status: Active; Minimum Order: 1; Number of Terminations: 2; Operating Temperature: -55°C ~ 155°C; Package / Case: 0603 (1608 Metric); Packaging: CutTape; PartId: 10611; Part Status: Active; Price: 0.10; Ratings: AEC-Q200; Resistance: 22 Ohms; Series: RMCF; Size / Dimension: 0.061" L x 0.031" W (1.55mm x 0.80mm); Supplier 1: DigiKey; Supplier Part Number 1: RMCF0603FT22R0CT-ND; Supplier Device Package: 0603; Tolerance: ±1%
R129#2 R131#2 R135#2 = RMCF0603JT10K0: as R117 on sheet NetworkSwitch; Part Number: RMCF0603JT10K0; Value: 10 kOhms; ComponentLink1Description: Datasheet; ComponentLink1URL: https://www.seielect.com/catalog/sei-packaging.pdf; ComponentLink2Description: DigiKey Link; ComponentLink2URL: http://digikey.com/product-detail/en/stackpole-electronics-inc/RMCF0603JT10K0/RMCF0603JT10K0CT-ND/1943191; Composition: Thick Film; Device Package: 0603 (1608 Metric); Features: Automotive AEC-Q200; Height - Seated (Max): 0.022" (0.55mm); LastUpdated: 9/2/2020 1:09:31 AM; Lifecycle Status: Active; Minimum Order: 1; Number of Terminations: 2; Operating Temperature: -55°C ~ 155°C; Package / Case: 0603 (1608 Metric); Packaging: CutTape; PartId: 25659; Part Status: Active; Price: 0.10; Ratings: AEC-Q200; Resistance: 10 kOhms; Series: RMCF; Size / Dimension: 0.061" L x 0.031" W (1.55mm x 0.80mm); Supplier 1: DigiKey; Supplier Part Number 1: RMCF0603JT10K0CT-ND; Supplier Device Package: 0603; Tolerance: ±5%
R130#2 R132#2 = RMCF0603FT330R: RES 330 OHM 1% 1/10W 0603; Manufacturer: Stackpole Electronics Inc; Power (Watts): 0.1W, 1/10W; Temperature Coefficient: ±100ppm/°C; Part Number: RMCF0603FT330R; Value: 330 Ohms; ComponentLink1Description: Datasheet; ComponentLink1URL: https://www.seielect.com/catalog/sei-rmcf_rmcp.pdf; ComponentLink2Description: DigiKey Link; ComponentLink2URL: http://digikey.com/product-detail/en/stackpole-electronics-inc/RMCF0603FT330R/RMCF0603FT330RCT-ND/1942981; Composition: Thick Film; Device Package: 0603 (1608 Metric); Features: Automotive AEC-Q200; Height - Seated (Max): 0.022" (0.55mm); LastUpdated: 9/2/2020 1:10:13 AM; Lifecycle Status: Active; Minimum Order: 1; Number of Terminations: 2; Operating Temperature: -55°C ~ 155°C; Package / Case: 0603 (1608 Metric); Packaging: CutTape; PartId: 10615; Part Status: Active; Price: 0.10; Ratings: AEC-Q200; Resistance: 330 Ohms; Series: RMCF; Size / Dimension: 0.061" L x 0.031" W (1.55mm x 0.80mm); Supplier 1: DigiKey; Supplier Part Number 1: RMCF0603FT330RCT-ND; Supplier Device Package: 0603; Tolerance: ±1%
R133#2 = RMCF0603FT200R: RES 200 OHM 1% 1/10W 0603; Manufacturer: Stackpole Electronics Inc; Power (Watts): 0.1W, 1/10W; Temperature Coefficient: ±100ppm/°C; Part Number: RMCF0603FT200R; Value: 200 Ohms; ComponentLink1Description: Datasheet; ComponentLink1URL: https://www.seielect.com/catalog/sei-packaging.pdf; ComponentLink2Description: DigiKey Link; ComponentLink2URL: http://digikey.com/product-detail/en/stackpole-electronics-inc/RMCF0603FT200R/RMCF0603FT200RCT-ND/1942972; Composition: Thick Film; Device Package: 0603 (1608 Metric); Features: Automotive AEC-Q200; Height - Seated (Max): 0.022" (0.55mm); LastUpdated: 9/2/2020 1:10:13 AM; Lifecycle Status: Active; Minimum Order: 1; Number of Terminations: 2; Operating Temperature: -55°C ~ 155°C; Package / Case: 0603 (1608 Metric); Packaging: CutTape; PartId: 10703; Part Status: Active; Price: 0.10; Ratings: AEC-Q200; Resistance: 200 Ohms; Series: RMCF; Size / Dimension: 0.061" L x 0.031" W (1.55mm x 0.80mm); Supplier 1: DigiKey; Supplier Part Number 1: RMCF0603FT200RCT-ND; Supplier Device Package: 0603; Tolerance: ±1%
R134#2 = RMCF0603FT6K04: as R124#1 on sheet NetworkSwitch; Part Number: RMCF0603FT6K04; Value: 6.04 kOhms; ComponentLink1Description: Datasheet; ComponentLink1URL: https://www.seielect.com/catalog/sei-rmcf_rmcp.pdf; ComponentLink2Description: DigiKey Link; ComponentLink2URL: http://digikey.com/product-detail/en/stackpole-electronics-inc/RMCF0603FT6K04/RMCF0603FT6K04CT-ND/1943041; Composition: Thick Film; Device Package: 0603 (1608 Metric); Features: Automotive AEC-Q200; Height - Seated (Max): 0.022" (0.55mm); LastUpdated: 9/2/2020 1:10:13 AM; Lifecycle Status: Active; Minimum Order: 1; Number of Terminations: 2; Operating Temperature: -55°C ~ 155°C; Package / Case: 0603 (1608 Metric); Packaging: CutTape; PartId: 10873; Part Status: Active; Price: 0.10; Ratings: AEC-Q200; Resistance: 6.04 kOhms; Series: RMCF; Size / Dimension: 0.061" L x 0.031" W (1.55mm x 0.80mm); Supplier 1: DigiKey; Supplier Part Number 1: RMCF0603FT6K04CT-ND; Supplier Device Package: 0603; Tolerance: ±1%
Y3 = TSX-3225 25.0000MF20P-C0: as Y2#1 on sheet NetworkSwitch; Part Number: TSX-3225 25.0000MF20P-C0; ComponentLink1Description: Datasheet; ComponentLink1URL: https://support.epson.biz/td/api/doc_check.php?dl=brief_TSX-3225&lang=en; ComponentLink2Description: DigiKey Link; ComponentLink2URL: http://digikey.com/product-detail/en/epson/TSX-3225-25.0000MF20P-C0/SER4212CT-ND/7430967; Frequency: 25MHz; Height - Seated (Max): 0.024" (0.60mm); LastUpdated: 9/2/2020 1:21:54 AM; Lifecycle Status: Active; Load Capacitance: 18pF; Minimum Order: 1; Mounting Type: Surface Mount; Operating Temperature: -20°C ~ 85°C; Package / Case: 4-SMD, No Lead; Packaging: TapeAndReel; PartId: 447; Part Status: Active; Price: 0.18; Series: TSX-3225; Size / Dimension: 0.126" L x 0.098" W (3.20mm x 2.50mm); Supplier 1: DigiKey; Supplier Part Number 1: SER4212CT-ND; Type: MHz Crystal; Value: 25MHz
U16 = SCH - CONTROLLER - ETHERNET - MICROCHIP LAN7431: Supplier 1: Mouser